# Altium schematic sheet 电源模块.SchDoc: RC1562L
size A4; Organization: 广东工程职业技术学院; Address1: 邹睿燮; Address2: 4****************9; Address3: 1905420313; SheetNumber: 1; SheetTotal: 4
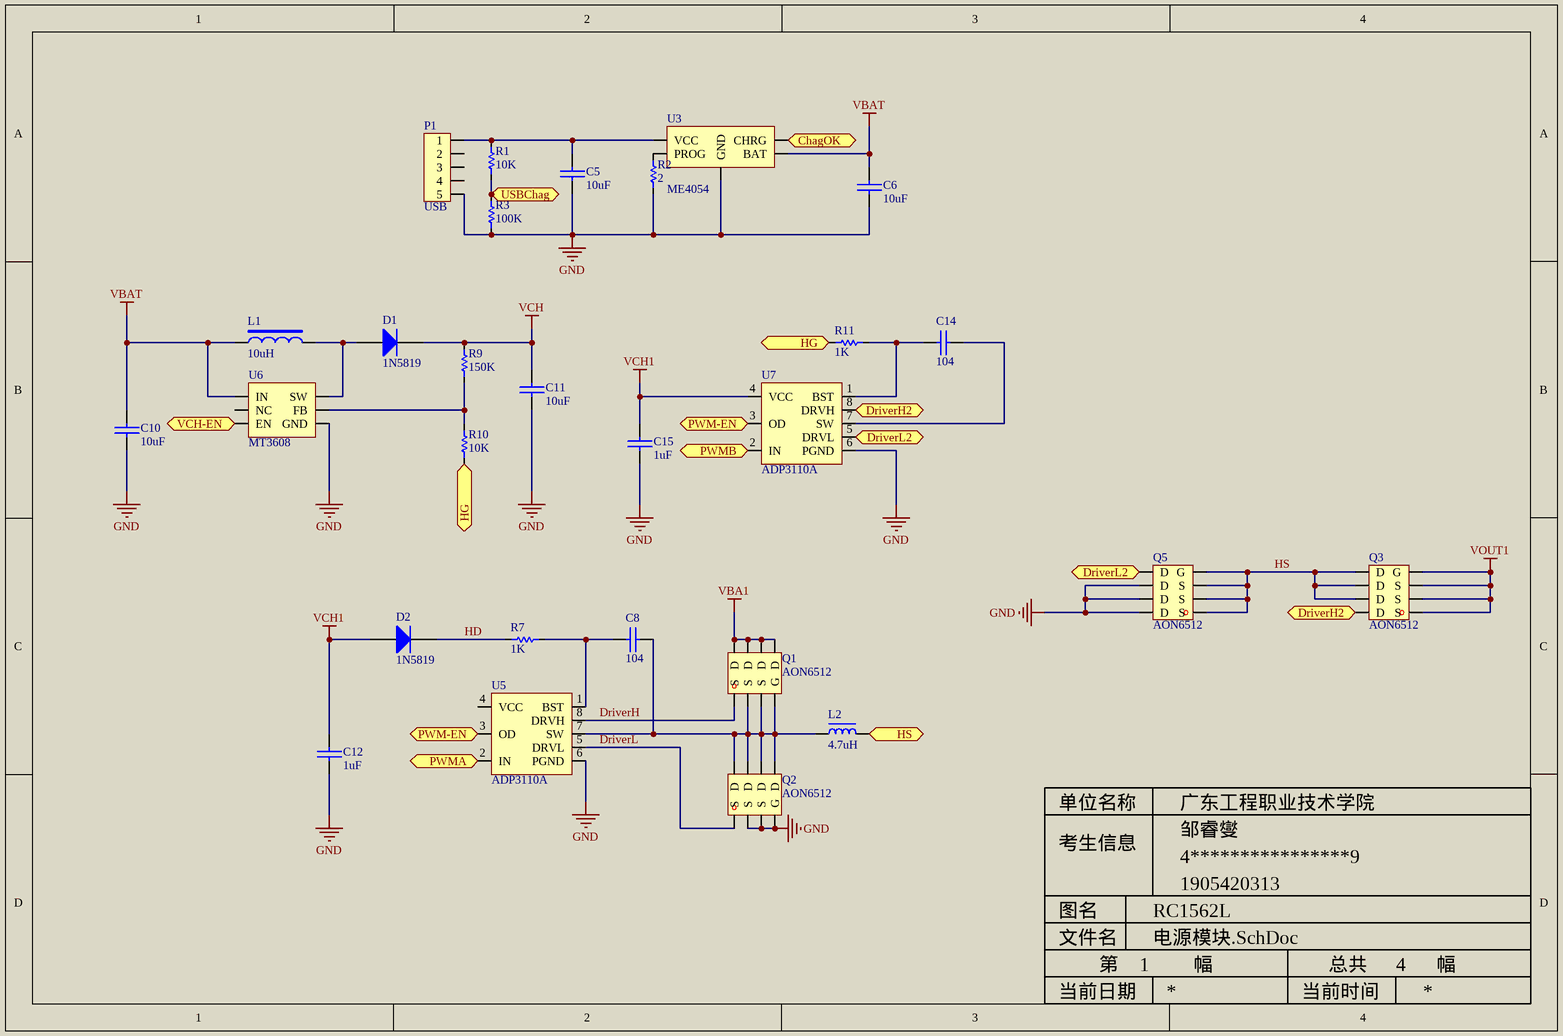
[diagram p0: 电源模块.SchDoc]

## Parts
C5  10uF  [6-0805_L]
C6  10uF  [6-0805_L]
C8  104  [6-0805_L]
C10  10uF  [6-0805_L]
C11  10uF  [6-0805_L]
C12  1uF  [6-0805_L]
C14  104  [6-0805_L]
C15  1uF  [6-0805_L]
D1  1N5819  [DO-41]
D2  1N5819  [DO-41]
L1  10uH  [CD32]
L2  4.7uH  [IND12_12]
P1  USB  [M-USB-V]
Q1  AON6512  [SON5_6mm]
Q2  AON6512  [SON5_6mm]
Q3  AON6512  [SON5_6mm]
Q5  AON6512  [SON5_6mm]
R1  10K  [6-0805_L]
R2  2  [6-0805_L]
R3  100K  [6-0805_L]
R7  1K  [6-0805_L]
R9  150K  [6-0805_L]
R10  10K  [6-0805_L]
R11  1K  [6-0805_L]
U3  ME4054  [SOT23-5]
U5  ADP3110A  [ADP3110A]
U6  MT3608  [SOT-23-6]
U7  ADP3110A  [ADP3110A]

## Ports
ChagOK, DriverH2, DriverL2, HG, HS, PWM-EN, PWMA, PWMB, USBChag, VCH-EN

## Nets
GND: C5.1 C6.1 C10.2 C11.1 C12.1 C15.1 P1.5 Q2.2(S) Q2.3(S) Q2.4(G) Q5.6(D) Q5.7(D) Q5.8(D) R2.1 R3.1 U3.2(GND) U5.6(PGND) U6.2(GND) U7.6(PGND)
VBA1: Q1.5(D) Q1.6(D) Q1.7(D) Q1.8(D)
VBAT: C6.2 C10.1 L1.1 U3.3(BAT) U6.5(IN)
VCH: C11.2 D1.2(K) R9.2
VCH1: C12.2 C15.2 D2.1(A) U7.4(VCC)
VOUT1: Q3.1(S) Q3.2(S) Q3.3(S) Q3.4(G)
ChagOK: U3.1(CHRG) ; port ChagOK
DriverH: Q1.1(S) U5.8(DRVH)
DriverH2: Q3.8(D) U7.8(DRVH) ; port DriverH2
DriverL: Q2.1(S) U5.5(DRVL)
DriverL2: Q5.5(D) U7.5(DRVL) ; port DriverL2
HD: D2.2(K) R7.2
HG: R10.1 R11.2 ; port HG
HS: Q3.5(D) Q3.6(D) Q3.7(D) Q5.1(S) Q5.2(S) Q5.3(S) Q5.4(G)
HS: L2.2 ; port HS  [a separate net that carries the same name]
PWM-EN: U5.3(OD) U7.3(OD) ; port PWM-EN
PWMA: U5.2(IN) ; port PWMA
PWMB: U7.2(IN) ; port PWMB
USBChag: R1.1 R3.2 ; port USBChag
VCH-EN: U6.4(EN) ; port VCH-EN
NetC5_2: C5.2 P1.1 R1.2 U3.4(VCC)
NetC8_1: C8.1 R7.1 U5.1(BST)
NetC8_2: C8.2 L2.1 Q1.2(S) Q1.3(S) Q1.4(G) Q2.5(D) Q2.6(D) Q2.7(D) Q2.8(D) U5.7(SW)
NetC14_1: C14.1 R11.1 U7.1(BST)
NetC14_2: C14.2 U7.7(SW)
NetD1_1: D1.1(A) L1.2 U6.1(SW)
NetR2_2: R2.2 U3.5(PROG)
NetR9_1: R9.1 R10.2 U6.3(FB)

Not connected (* = marked no-connect by the designer): P1 2 3 4; U5 4(VCC); U6 6(NC)

## Notes on the sheet
- 单位名称
- 考生信息
- 图名
- 文件名
- 第
- 幅
- 总共
- 当前日期
- 当前时间

## Library data of the parts
C5 C6 C8 C10-C12 C14 C15 = CAP: Capacitor
D1 D2 = Diode 1N4001: 1 Amp General Purpose Rectifier; Published: 8-Jun-2000; LatestRevisionDate: 17-Jul-2002; LatestRevisionNote: Re-released for DXP Platform.; DatasheetVersion: 1998; PackageVersion: Aug-1999; PackageReference: DO-41; Publisher: Altium Limited; PackageDescription: Diode, Axial; Body 5.2 x 2.7 mm (LxDia. max), Lead Dia. 0.86 mm (max); Code_JEDEC: DO-204-AL; ComponentLink1Description: Manufacturer Link; ComponentLink1URL: http://www.fairchildsemi.com/; ComponentLink2Description: Datasheet; ComponentLink2URL: http://www.fairchildsemi.com/ds/1N%2F1N4001.pdf
L1 = INDUCTOR2
L2 = INDUCTOR
P1 = 5 PIN CONNECTOR
Q1-Q3 Q5 = MOS: Singe 8pin; WSD3030DS: WSD3030DS; SI4477: SI4477; NCE3035Q: NCE3035Q
R1-R3 R7 R9-R11 = Res1_1: Resistor; Published: 8-Jun-2000; LatestRevisionDate: 17-Jul-2002; LatestRevisionNote: Re-released for DXP Platform.; PackageReference: AXIAL-0.3; Publisher: Altium Limited; PackageDescription: Axial Device, Thru-Hole; 2 Leads; 0.3 in Pin Spacing